# EAGLE design NanjaTown02_switch (EAGLE 9.1.0)
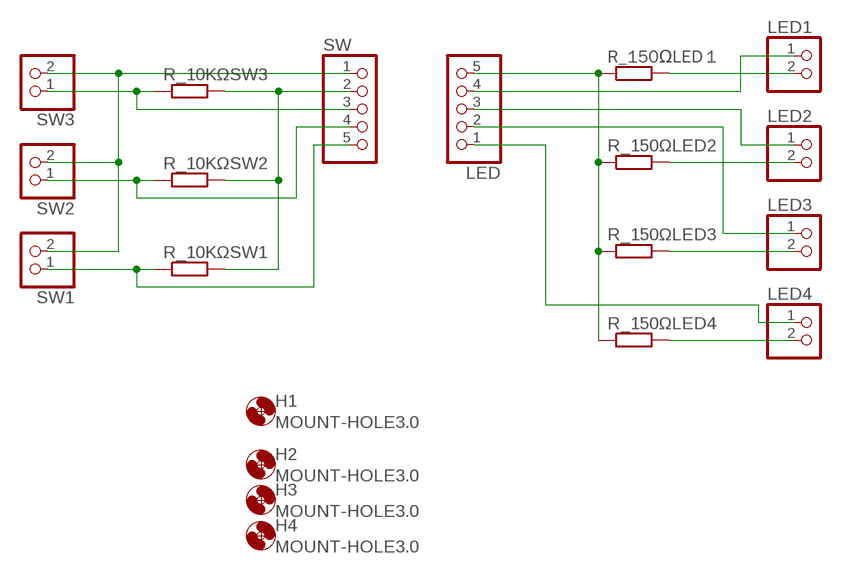
[diagram p0: schematic, sheet 1]

## Parts
H1  MOUNT-HOLE3.0  [3,0]
H2  MOUNT-HOLE3.0  [3,0]
H3  MOUNT-HOLE3.0  [3,0]
H4  MOUNT-HOLE3.0  [3,0]
LED  PINHD-1X5  [1X05]
LED1  PINHD-1X2  [1X02]
LED2  PINHD-1X2  [1X02]
LED3  PINHD-1X2  [1X02]
LED4  PINHD-1X2  [1X02]
R_10KΩSW1  R-EU_0207/10  [0207/10]
R_10KΩSW2  R-EU_0207/10  [0207/10]
R_10KΩSW3  R-EU_0207/10  [0207/10]
R_150ΩLED2  R-EU_0207/10  [0207/10]
R_150ΩLED3  R-EU_0207/10  [0207/10]
R_150ΩLED4  R-EU_0207/10  [0207/10]
R_150ΩLED１  R-EU_0207/10  [0207/10]
SW  PINHD-1X5  [1X05]
SW1  PINHD-1X2  [1X02]
SW2  PINHD-1X2  [1X02]
SW3  PINHD-1X2  [1X02]

## Nets
N$1: SW1.2 SW2.2 SW3.2 SW.1
N$2: R_10KΩSW3.1 SW3.1 SW.3
N$3: R_10KΩSW2.1 SW2.1 SW.4
N$4: R_10KΩSW1.1 SW1.1 SW.5
N$5: R_10KΩSW1.2 R_10KΩSW2.2 R_10KΩSW3.2 SW.2
N$6: LED.5 R_150ΩLED2.1 R_150ΩLED3.1 R_150ΩLED4.1 R_150ΩLED１.1
N$7: LED1.2 R_150ΩLED１.2
N$8: LED2.2 R_150ΩLED2.2
N$9: LED3.2 R_150ΩLED3.2
N$10: LED4.2 R_150ΩLED4.2
N$11: LED1.1 LED.4
N$12: LED2.1 LED.3
N$13: LED3.1 LED.2
N$14: LED4.1 LED.1

## Library data of the parts
H1-H4 = holes:MOUNT-HOLE: MOUNTING HOLE with drill center marker
LED SW = pinhead:PINHD-1X5: PIN HEADER
LED1-LED4 SW1-SW3 = pinhead:PINHD-1X2: PIN HEADER
R_10KΩSW1-R_10KΩSW3 R_150ΩLED2-R_150ΩLED4 R_150ΩLED１ = rcl:R-EU_: RESISTOR, European symbol; SPICEPREFIX: R

## Net classes
0 default: width 0.6 mm, clearance 0.4 mm

## Board
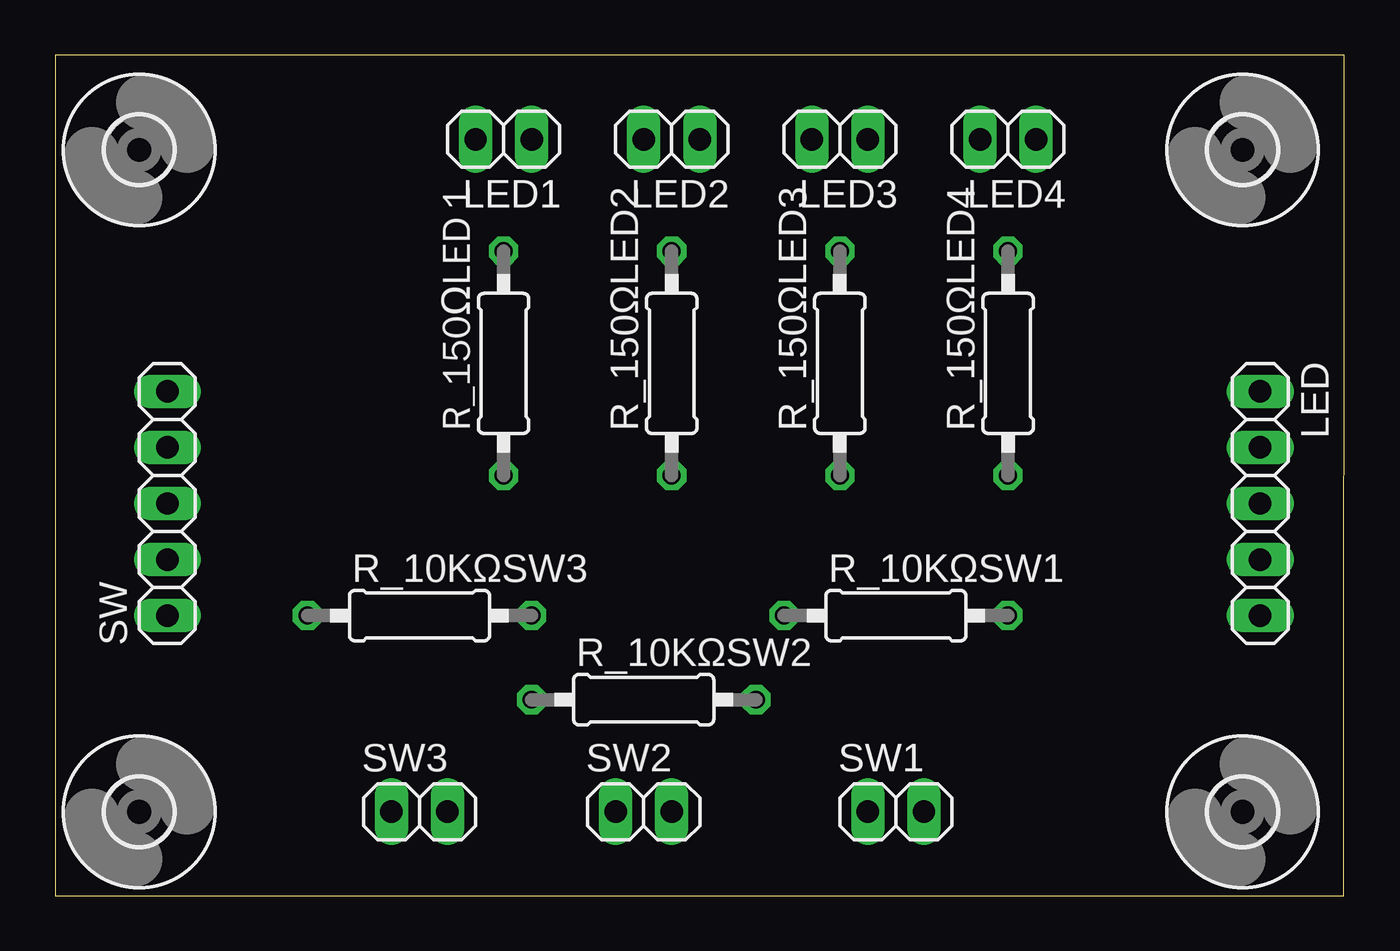
[diagram p1: board, top side]
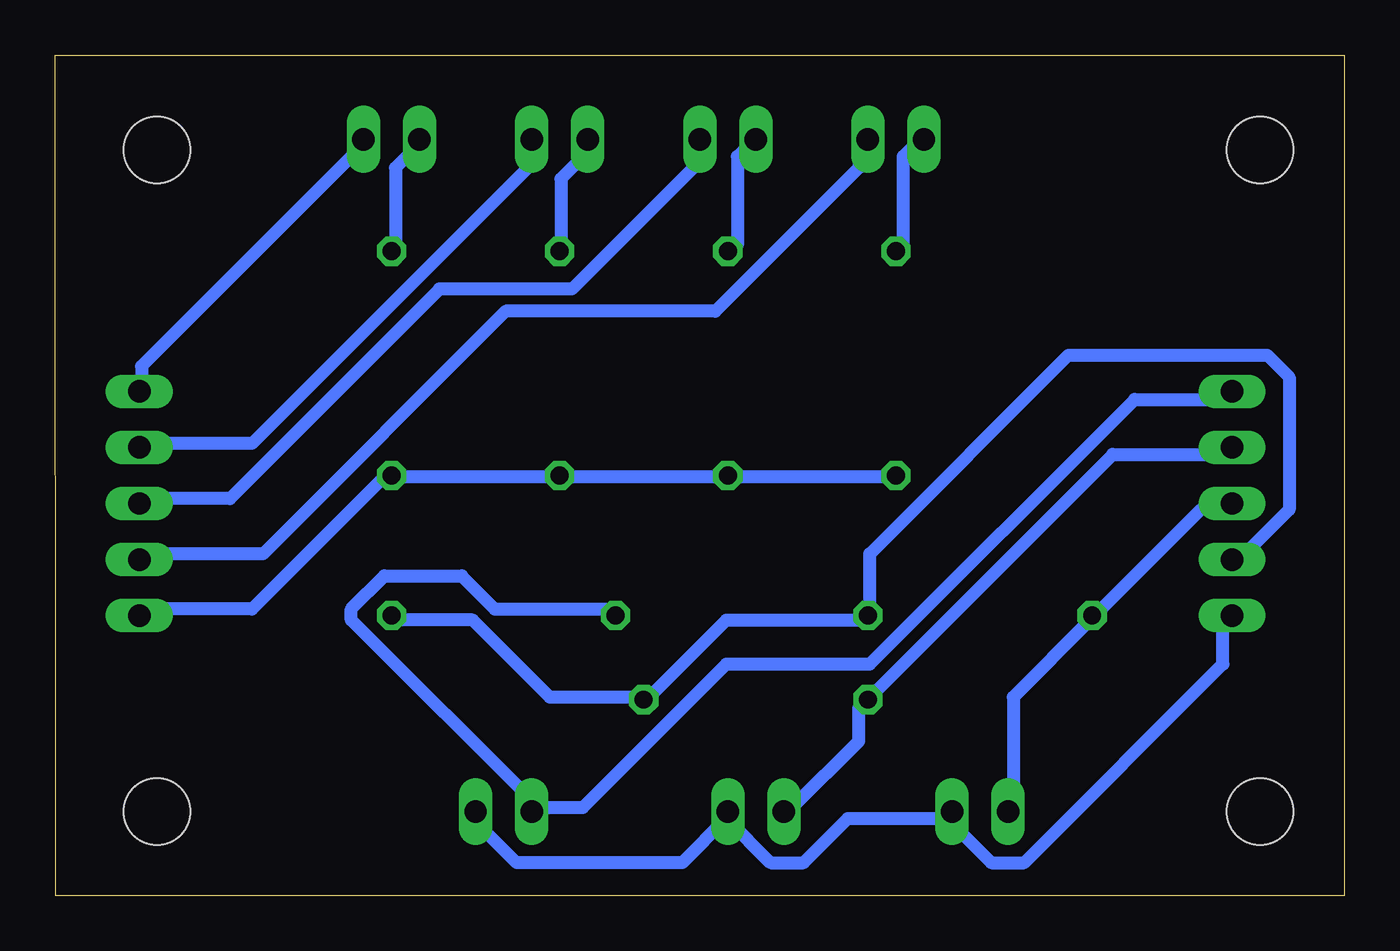
[diagram p2: board, bottom side, seen from below]

Size 58.42 x 38.1 mm. Coordinates in mm from the lower left corner, seen from the top.
Outline: 0,0 58.4,0 58.42,38.1 0,38.1 0,0
Copper layers (1*16): Top 0.035mm / dielectric 1.5mm / Bottom 0.035mm
Design rules "default": minimum track width 6mil, minimum drill 0.35mm, track to track 6mil, track to pad 6mil, pad to pad 6mil, via to via 6mil, smd to smd 6mil, copper to edge 40mil, drill to drill 6mil, minimum pad ring 10mil, minimum via ring 8mil, stop-mask expansion 4mil, vias tented up to drill 0mil, thermal gap 10mil

### Footprints (pad centres in the part's own frame; a part is rotated, then mirrored left to right if it is on the bottom)
3,0 = hole 3: 0,0
1X05 = drill 1.016 long: 1 -5.08,0; 2 -2.54,0; 3 0,0; 4 2.54,0; 5 5.08,0
1X02 = drill 1.016 long: 1 -1.27,0; 2 1.27,0
0207/10 = drill 0.813 octagon: 1 -5.08,0; 2 5.08,0

### Placement (x,y rotation side)
H1  3.81,3.81 0 top
H2  3.81,33.81 0 top
H3  53.81,3.81 0 top
H4  53.81,33.81 0 top
LED  54.61,17.78 270 top
LED1  20.32,34.29 180 top
LED2  27.94,34.29 180 top
LED3  35.56,34.29 180 top
LED4  43.18,34.29 180 top
R_10KΩSW1  38.1,12.7 0 top
R_10KΩSW2  26.67,8.89 0 top
R_10KΩSW3  16.51,12.7 0 top
R_150ΩLED2  27.94,24.13 90 top
R_150ΩLED3  35.56,24.13 90 top
R_150ΩLED4  43.18,24.13 90 top
R_150ΩLED１  20.32,24.13 90 top
SW  5.08,17.78 90 top
SW1  38.1,3.81 0 top
SW2  26.67,3.81 0 top
SW3  16.51,3.81 0 top

### Tracks (layer width: path | path; a pad name or v marks a point on that pad's centre or on a via)
N$1
  Bottom 0.6: 18,3.5 22.5,3.5 24.5,1.5 26,1.5 28,3.5 | 18,3.5 SW3.2 18,3.5 | 28,3.5 SW2.2 28,3.5 | 28,3.5 30,1.5 37.5,1.5 39,3 39,3.5 SW1.2 | 18,3.5 16,1.5 14.5,1.5 5.5,10.5 5.5,12.5 SW.1
N$2
  Bottom 0.6: SW.3 5.5,17.5 6.5,17.5 11,13 R_10KΩSW3.1 11.5,12.5 15,9 15,4 SW3.1
N$3
  Bottom 0.6: SW2.1 25,4 22,7 22,8.5 R_10KΩSW2.1 21.5,9 10.5,20 5.5,20 SW.4
N$4
  Bottom 0.6: 36.5,4 45,12.5 45,13 43.5,14.5 40,14.5 38.5,13 33.5,13 R_10KΩSW1.1 | 36.5,4 SW1.1 36.5,4 | 36.5,4 34.5,4 28,10.5 21.5,10.5 9.5,22.5 5.5,22.5 SW.5
N$5
  Bottom 0.6: R_10KΩSW1.2 43,12.5 39.5,12.5 36,9 32,9 R_10KΩSW2.2 31.5,9 28,12.5 22,12.5 R_10KΩSW3.2 21.5,13 21.5,15.5 12.5,24.5 3.5,24.5 2.5,23.5 2.5,17.5 4.5,15.5 5,15.5 SW.2
N$6
  Bottom 0.6: R_150ΩLED１.1 20.5,19 27.5,19 R_150ΩLED2.1 28,19 35.5,19 R_150ΩLED3.1 36,19 43,19 R_150ΩLED4.1 43.5,19 49.5,13 54.5,13 LED.5
N$7
  Bottom 0.6: R_150ΩLED１.2 20,29.5 20,33.5 19.5,34 LED1.2
N$8
  Bottom 0.6: R_150ΩLED2.2 27.5,29.5 27.5,33.5 27,34 LED2.2
N$9
  Bottom 0.6: R_150ΩLED3.2 35.5,29.5 35.5,32.5 34,34 LED3.2
N$10
  Bottom 0.6: R_150ΩLED4.2 43,29.5 43,33 42,34 LED4.2
N$11
  Bottom 0.6: LED.4 54.5,15.5 49,15.5 38,26.5 28.5,26.5 22,33 22,34 LED1.1
N$12
  Bottom 0.6: LED.3 54.5,18 50.5,18 41,27.5 35,27.5 29.5,33 29.5,34 LED2.1
N$13
  Bottom 0.6: LED.2 54.5,20.5 49.5,20.5 37,33 37,34 LED3.1
N$14
  Bottom 0.6: LED.1 54.5,23 54.5,24 44.5,34 LED4.1